# EAGLE design CN-Cape003 ohne HDMI (EAGLE 7.2.0)

## Sheet 1 of 5: Spannungsversorgung Verpolungsschutz ? Größe der Sicherung ? 1A oder 3A für Servos?
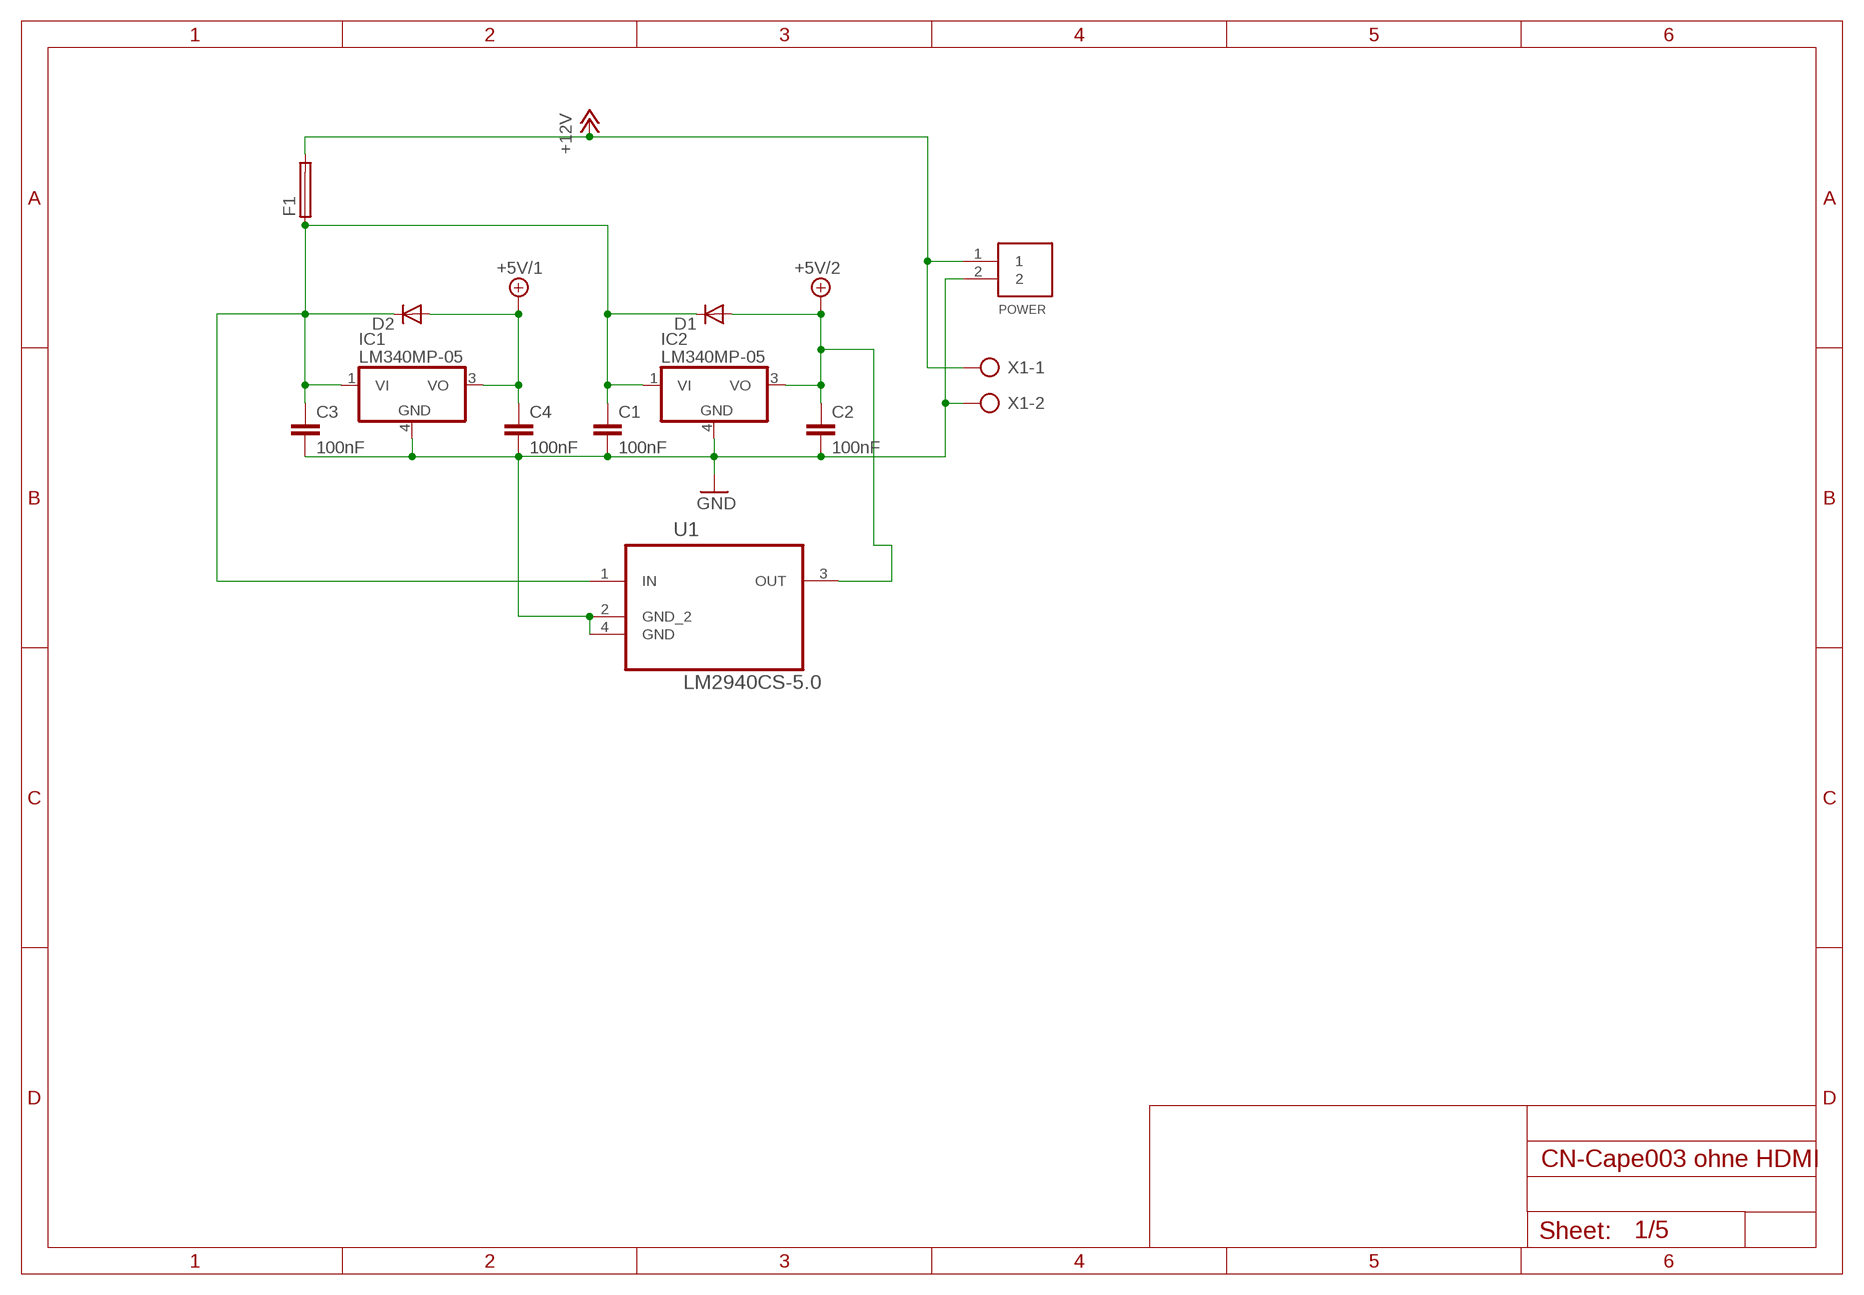
[diagram p0: schematic, sheet 1]

### Parts
C1  100nF  C-EUC0805  [C0805]
C2  100nF  C-EUC0805  [C0805]
C3  100nF  C-EUC0805  [C0805]
C4  100nF  C-EUC0805  [C0805]
D1  DIODE-SOD123  [SOD123]
D2  DIODE-SOD123  [SOD123]
F1  SH22,5  [SH22,5]
IC1  LM340MP-05  [SOT223]
IC2  LM340MP-05  [SOT223]
POWER  S2PIN  [S2B-EH]
U1  LM2940CS-5.0  [TO254P1435X464-4N]
X1  AK500/2-H  [AK500/2-H]

### Nets
12V_FUSED: C1.1 C3.1 D1.C D2.C F1.1 IC1.1(VI) IC2.1(VI) U1.1(IN)
+5V/1: C4.1 D2.A IC1.3(VO) ; also sheet 2,3,4
+5V/2: C2.1 D1.A IC2.3(VO) U1.3(OUT) ; also sheet 4,5
+12V: F1.2 POWER.1 X1.1
GND: C1.2 C2.2 C3.2 C4.2 IC1.4(GND) IC2.4(GND) POWER.2 U1.2(GND_2) U1.4(GND) X1.2 ; also sheet 2,3,4,5

## Sheet 2 of 5: BeagleBoard Black Expansion Header
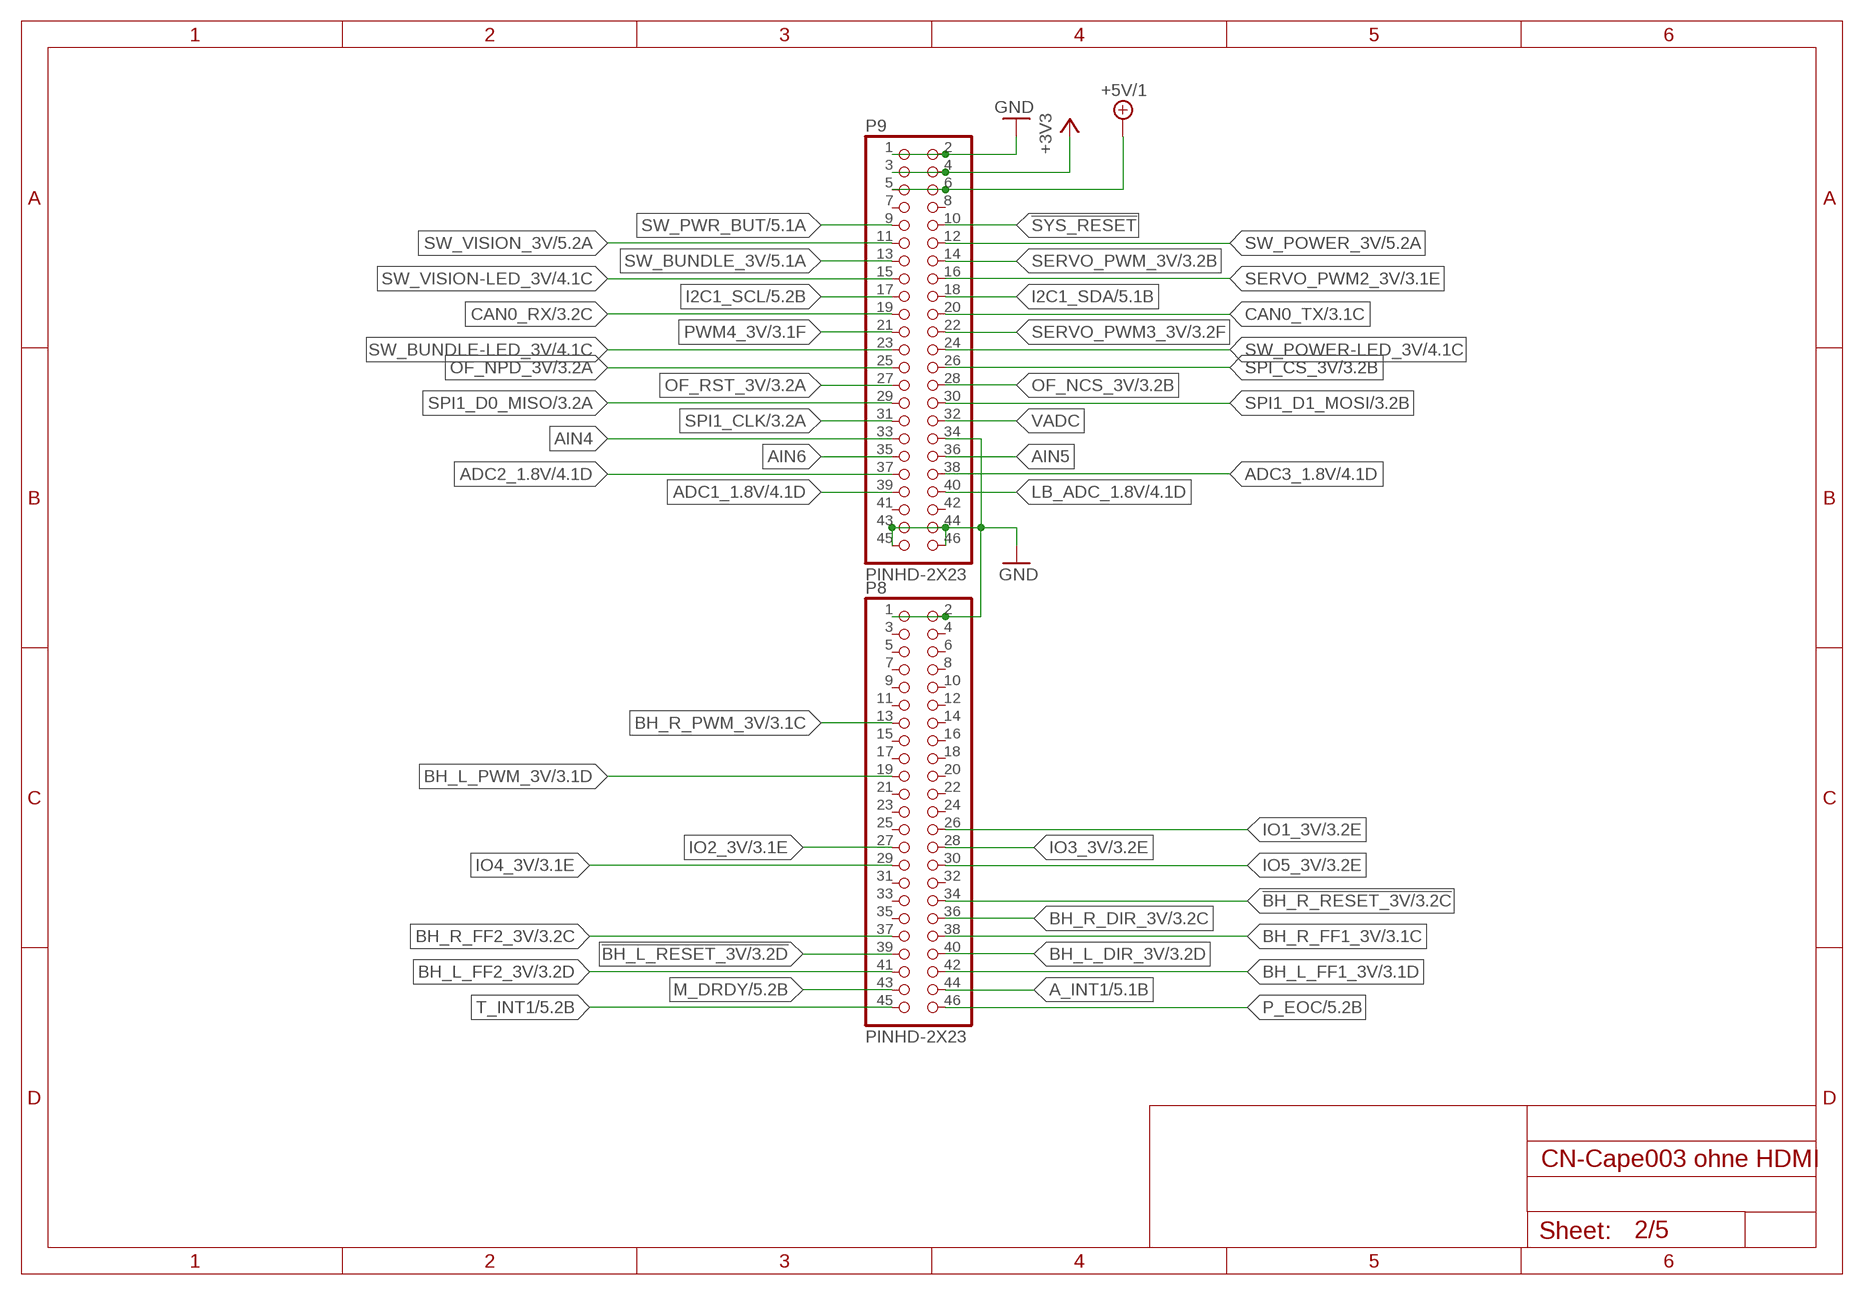
[diagram p1: schematic, sheet 2]

### Parts
P8  PINHD-2X23  [2X23]
P9  PINHD-2X23  [2X23]

### Nets
!BH_L_RESET_3V: P8.39 ; also sheet 3
!BH_R_RESET_3V: P8.34 ; also sheet 3
!SYS_RESET: P9.10
+3V3: P9.3 P9.4 ; also sheet 3,5
+5V/1: P9.5 P9.6 ; also sheet 1,3,4
A_INT1: P8.44 ; also sheet 5
ADC1_1.8V: P9.39 ; also sheet 4
ADC2_1.8V: P9.37 ; also sheet 4
ADC3_1.8V: P9.38 ; also sheet 4
AIN4: P9.33
AIN5: P9.36
AIN6: P9.35
BH_L_DIR_3V: P8.40 ; also sheet 3
BH_L_FF1_3V: P8.42 ; also sheet 3
BH_L_FF2_3V: P8.41 ; also sheet 3
BH_L_PWM_3V: P8.19 ; also sheet 3
BH_R_DIR_3V: P8.36 ; also sheet 3
BH_R_FF1_3V: P8.38 ; also sheet 3
BH_R_FF2_3V: P8.37 ; also sheet 3
BH_R_PWM_3V: P8.13 ; also sheet 3
CAN0_RX: P9.19 ; also sheet 3
CAN0_TX: P9.20 ; also sheet 3
GND: P8.1 P8.2 P9.1 P9.2 P9.34 P9.43 P9.44 P9.45 P9.46 ; also sheet 1,3,4,5
I2C1_SCL: P9.17 ; also sheet 5
I2C1_SDA: P9.18 ; also sheet 5
IO1_3V: P8.26 ; also sheet 3
IO2_3V: P8.27 ; also sheet 3
IO3_3V: P8.28 ; also sheet 3
IO4_3V: P8.29 ; also sheet 3
IO5_3V: P8.30 ; also sheet 3
LB_ADC_1.8V: P9.40 ; also sheet 4
M_DRDY: P8.43 ; also sheet 5
OF_NCS_3V: P9.28 ; also sheet 3
OF_NPD_3V: P9.25 ; also sheet 3
OF_RST_3V: P9.27 ; also sheet 3
P_EOC: P8.46 ; also sheet 5
PWM4_3V: P9.21 ; also sheet 3
SERVO_PWM2_3V: P9.16 ; also sheet 3
SERVO_PWM3_3V: P9.22 ; also sheet 3
SERVO_PWM_3V: P9.14 ; also sheet 3
SPI1_CLK: P9.31 ; also sheet 3
SPI1_D0_MISO: P9.29 ; also sheet 3
SPI1_D1_MOSI: P9.30 ; also sheet 3
SPI_CS_3V: P9.26 ; also sheet 3
SW_BUNDLE-LED_3V: P9.23 ; also sheet 4
SW_BUNDLE_3V: P9.13 ; also sheet 5
SW_POWER-LED_3V: P9.24 ; also sheet 4
SW_POWER_3V: P9.12 ; also sheet 5
SW_PWR_BUT: P9.9 ; also sheet 5
SW_VISION-LED_3V: P9.15 ; also sheet 4
SW_VISION_3V: P9.11 ; also sheet 5
T_INT1: P8.45 ; also sheet 5
VADC: P9.32
Unconnected: P8.3 P8.4 P8.5 P8.6 P8.7 P8.8 P8.9 P8.10 P8.11 P8.12 P8.14 P8.15 P8.16 P8.17 P8.18 P8.20 P8.21 P8.22 P8.23 P8.24 P8.25 P8.31 P8.32 P8.33 P8.35 P9.7 P9.8 P9.41 P9.42

## Sheet 3 of 5: Level Shifter
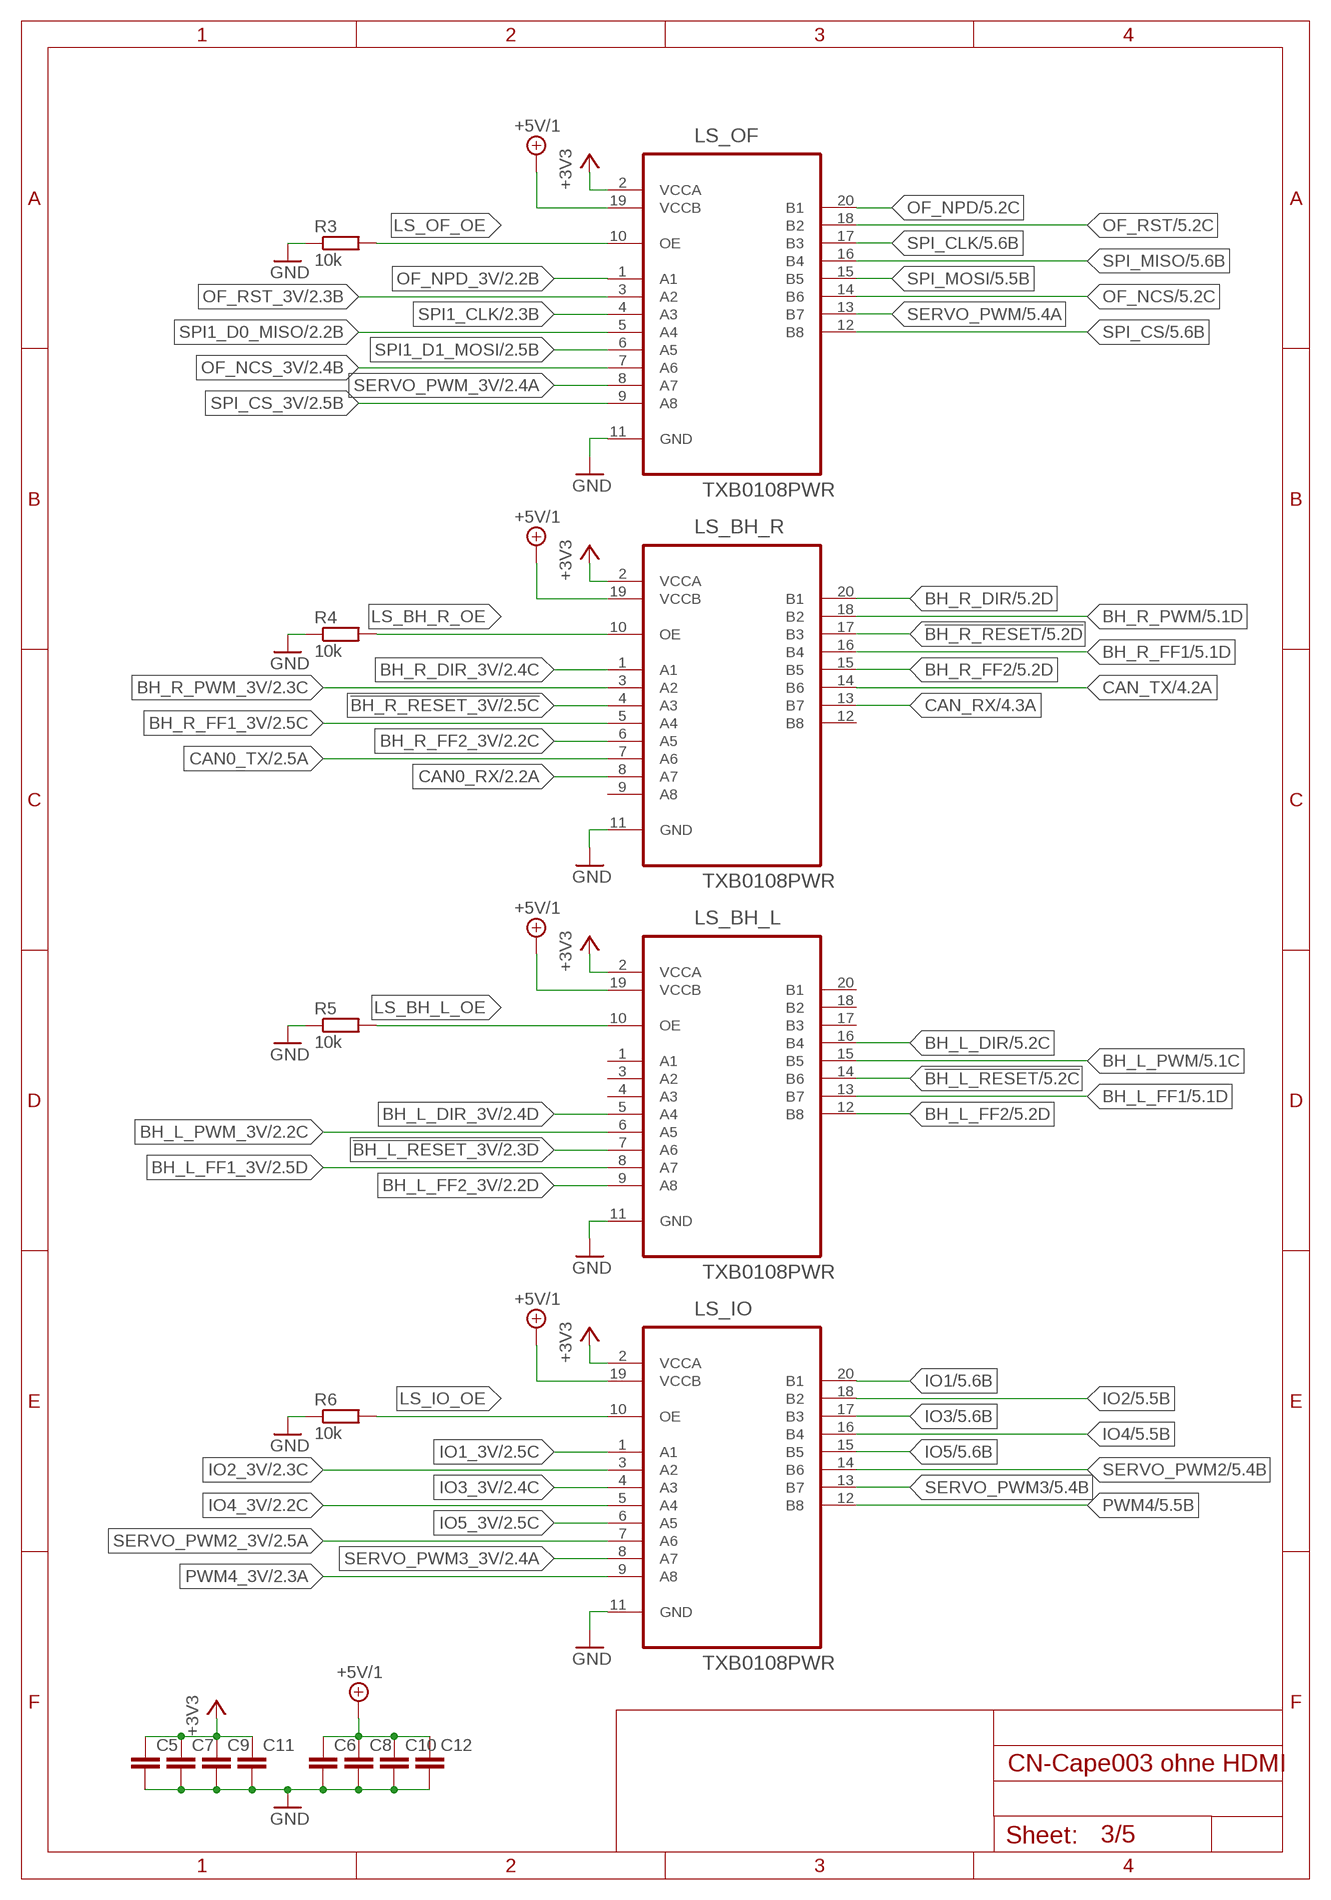
[diagram p2: schematic, sheet 3]

### Parts
C5  C-EUC0805  [C0805]
C6  C-EUC0805  [C0805]
C7  C-EUC0805  [C0805]
C8  C-EUC0805  [C0805]
C9  C-EUC0805  [C0805]
C10  C-EUC0805  [C0805]
C11  C-EUC0805  [C0805]
C12  C-EUC0805  [C0805]
LS_BH_L  TXB0108PWR  [SOP65P640X120-20N]
LS_BH_R  TXB0108PWR  [SOP65P640X120-20N]
LS_IO  TXB0108PWR  [SOP65P640X120-20N]
LS_OF  TXB0108PWR  [SOP65P640X120-20N]
R3  10k  R-EU_R0603  [R0603]
R4  10k  R-EU_R0603  [R0603]
R5  10k  R-EU_R0603  [R0603]
R6  10k  R-EU_R0603  [R0603]

### Nets
!BH_L_RESET: LS_BH_L.14(B6) ; also sheet 5
!BH_L_RESET_3V: LS_BH_L.7(A6) ; also sheet 2
!BH_R_RESET: LS_BH_R.17(B3) ; also sheet 5
!BH_R_RESET_3V: LS_BH_R.4(A3) ; also sheet 2
+3V3: C5.1 C7.1 C9.1 C11.1 LS_BH_L.2(VCCA) LS_BH_R.2(VCCA) LS_IO.2(VCCA) LS_OF.2(VCCA) ; also sheet 2,5
+5V/1: C6.1 C8.1 C10.1 C12.1 LS_BH_L.19(VCCB) LS_BH_R.19(VCCB) LS_IO.19(VCCB) LS_OF.19(VCCB) ; also sheet 1,2,4
BH_L_DIR: LS_BH_L.16(B4) ; also sheet 5
BH_L_DIR_3V: LS_BH_L.5(A4) ; also sheet 2
BH_L_FF1: LS_BH_L.13(B7) ; also sheet 5
BH_L_FF1_3V: LS_BH_L.8(A7) ; also sheet 2
BH_L_FF2: LS_BH_L.12(B8) ; also sheet 5
BH_L_FF2_3V: LS_BH_L.9(A8) ; also sheet 2
BH_L_PWM: LS_BH_L.15(B5) ; also sheet 5
BH_L_PWM_3V: LS_BH_L.6(A5) ; also sheet 2
BH_R_DIR: LS_BH_R.20(B1) ; also sheet 5
BH_R_DIR_3V: LS_BH_R.1(A1) ; also sheet 2
BH_R_FF1: LS_BH_R.16(B4) ; also sheet 5
BH_R_FF1_3V: LS_BH_R.5(A4) ; also sheet 2
BH_R_FF2: LS_BH_R.15(B5) ; also sheet 5
BH_R_FF2_3V: LS_BH_R.6(A5) ; also sheet 2
BH_R_PWM: LS_BH_R.18(B2) ; also sheet 5
BH_R_PWM_3V: LS_BH_R.3(A2) ; also sheet 2
CAN0_RX: LS_BH_R.8(A7) ; also sheet 2
CAN0_TX: LS_BH_R.7(A6) ; also sheet 2
CAN_RX: LS_BH_R.13(B7) ; also sheet 4
CAN_TX: LS_BH_R.14(B6) ; also sheet 4
GND: C5.2 C6.2 C7.2 C8.2 C9.2 C10.2 C11.2 C12.2 LS_BH_L.11(GND) LS_BH_R.11(GND) LS_IO.11(GND) LS_OF.11(GND) R3.1 R4.1 R5.1 R6.1 ; also sheet 1,2,4,5
IO1: LS_IO.20(B1) ; also sheet 5
IO1_3V: LS_IO.1(A1) ; also sheet 2
IO2: LS_IO.18(B2) ; also sheet 5
IO2_3V: LS_IO.3(A2) ; also sheet 2
IO3: LS_IO.17(B3) ; also sheet 5
IO3_3V: LS_IO.4(A3) ; also sheet 2
IO4: LS_IO.16(B4) ; also sheet 5
IO4_3V: LS_IO.5(A4) ; also sheet 2
IO5: LS_IO.15(B5) ; also sheet 5
IO5_3V: LS_IO.6(A5) ; also sheet 2
LS_BH_L_OE: LS_BH_L.10(OE) R5.2
LS_BH_R_OE: LS_BH_R.10(OE) R4.2
LS_IO_OE: LS_IO.10(OE) R6.2
LS_OF_OE: LS_OF.10(OE) R3.2
OF_NCS: LS_OF.14(B6) ; also sheet 5
OF_NCS_3V: LS_OF.7(A6) ; also sheet 2
OF_NPD: LS_OF.20(B1) ; also sheet 5
OF_NPD_3V: LS_OF.1(A1) ; also sheet 2
OF_RST: LS_OF.18(B2) ; also sheet 5
OF_RST_3V: LS_OF.3(A2) ; also sheet 2
PWM4: LS_IO.12(B8) ; also sheet 5
PWM4_3V: LS_IO.9(A8) ; also sheet 2
SERVO_PWM: LS_OF.13(B7) ; also sheet 5
SERVO_PWM2: LS_IO.14(B6) ; also sheet 5
SERVO_PWM2_3V: LS_IO.7(A6) ; also sheet 2
SERVO_PWM3: LS_IO.13(B7) ; also sheet 5
SERVO_PWM3_3V: LS_IO.8(A7) ; also sheet 2
SERVO_PWM_3V: LS_OF.8(A7) ; also sheet 2
SPI1_CLK: LS_OF.4(A3) ; also sheet 2
SPI1_D0_MISO: LS_OF.5(A4) ; also sheet 2
SPI1_D1_MOSI: LS_OF.6(A5) ; also sheet 2
SPI_CLK: LS_OF.17(B3) ; also sheet 5
SPI_CS: LS_OF.12(B8) ; also sheet 5
SPI_CS_3V: LS_OF.9(A8) ; also sheet 2
SPI_MISO: LS_OF.16(B4) ; also sheet 5
SPI_MOSI: LS_OF.15(B5) ; also sheet 5
Unconnected: LS_BH_L.1(A1) LS_BH_L.3(A2) LS_BH_L.4(A3) LS_BH_L.17(B3) LS_BH_L.18(B2) LS_BH_L.20(B1) LS_BH_R.9(A8) LS_BH_R.12(B8)

## Sheet 4 of 5: CAN- Bus & LED Transistoren
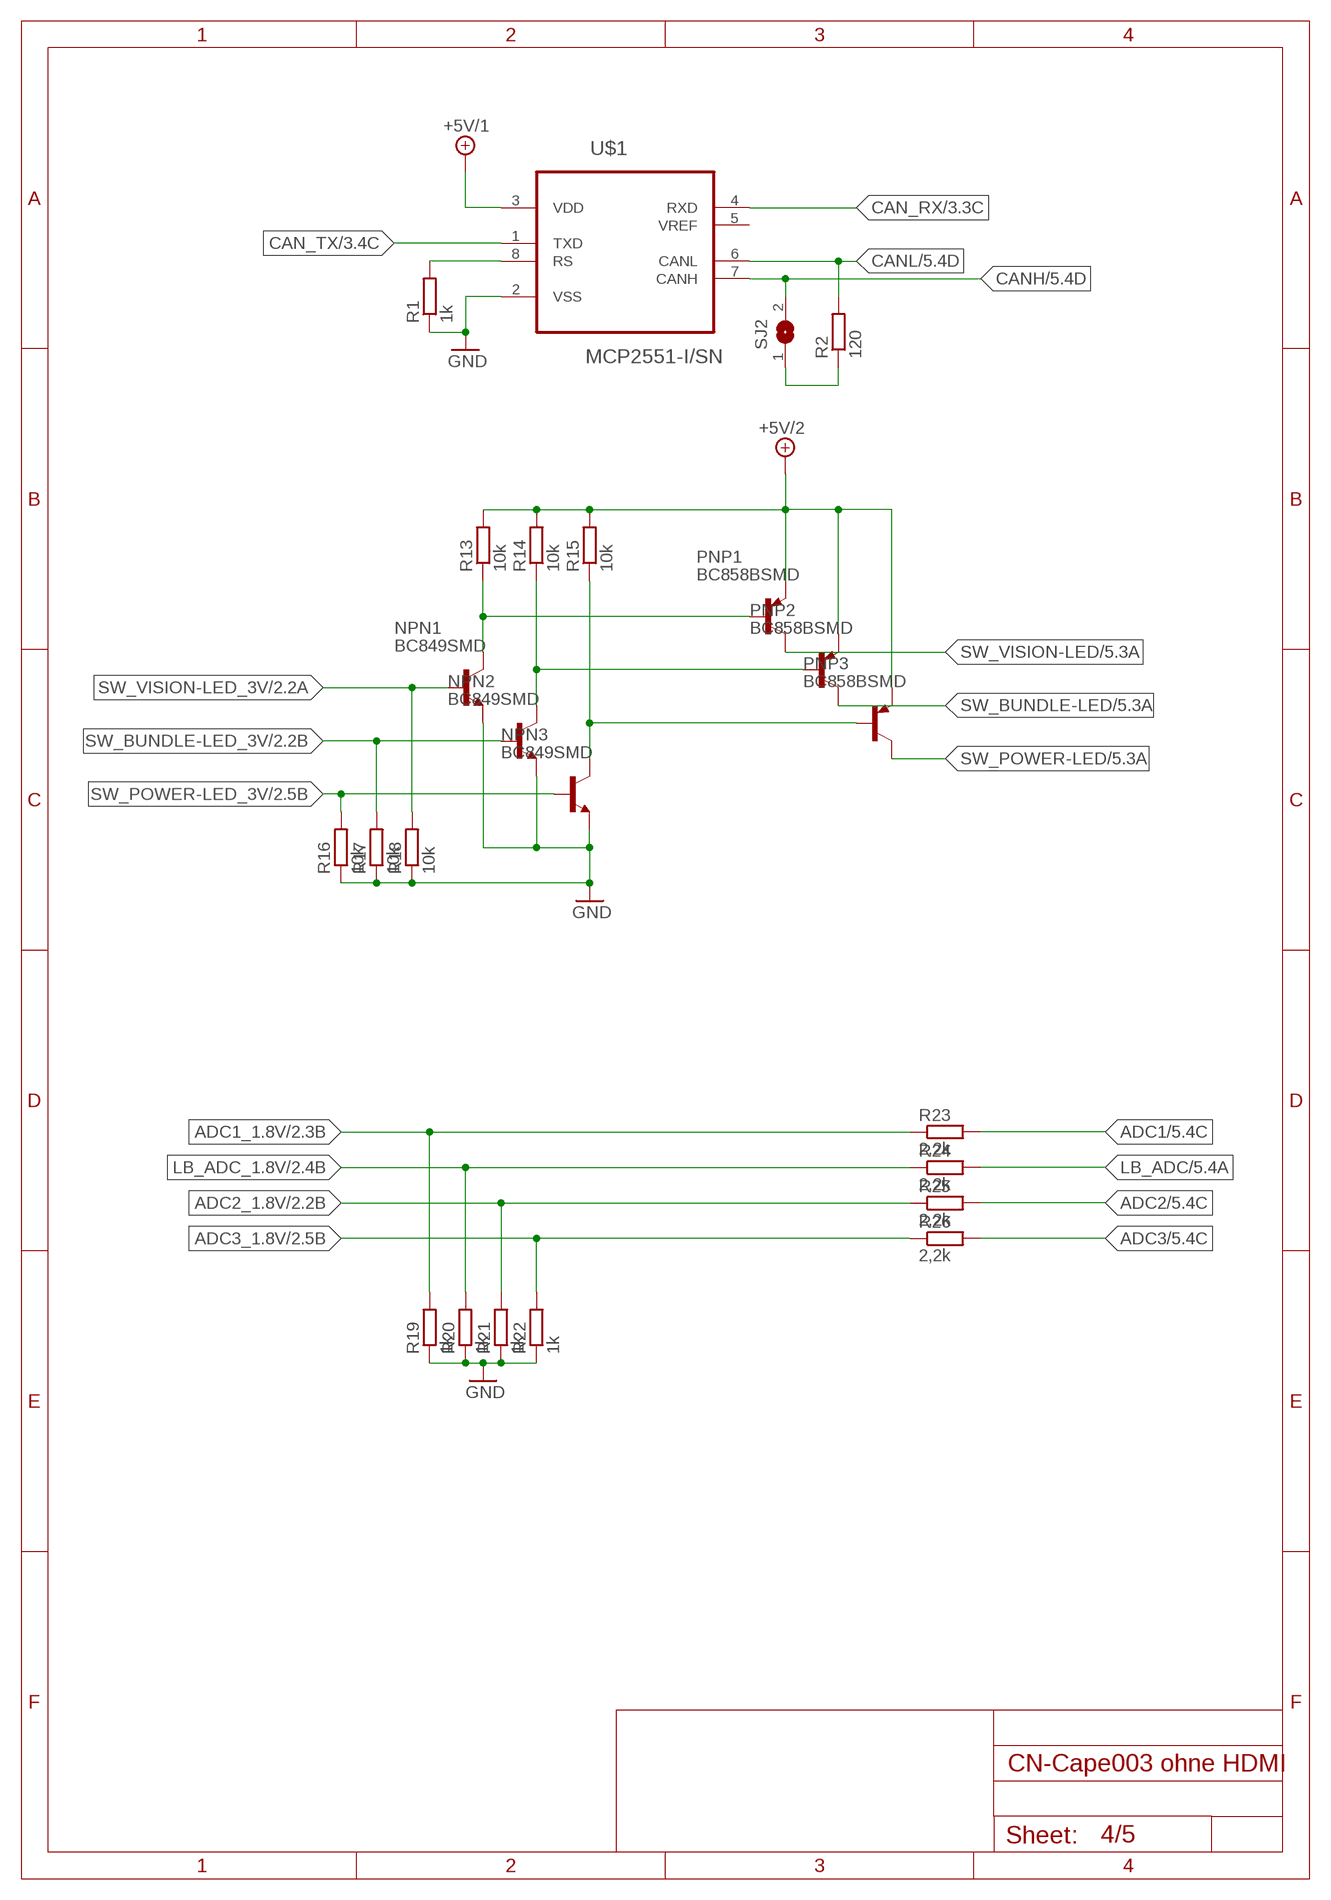
[diagram p3: schematic, sheet 4]

### Parts
NPN1  BC849SMD  [SOT23-BEC]
NPN2  BC849SMD  [SOT23-BEC]
NPN3  BC849SMD  [SOT23-BEC]
PNP1  BC858BSMD  [SOT23-BEC]
PNP2  BC858BSMD  [SOT23-BEC]
PNP3  BC858BSMD  [SOT23-BEC]
R1  1k  R-EU_R0603  [R0603]
R2  120  R-EU_R0603  [R0603]
R13  10k  R-EU_R0603  [R0603]
R14  10k  R-EU_R0603  [R0603]
R15  10k  R-EU_R0603  [R0603]
R16  10k  R-EU_R0603  [R0603]
R17  10k  R-EU_R0603  [R0603]
R18  10k  R-EU_R0603  [R0603]
R19  1k  R-EU_R0603  [R0603]
R20  1k  R-EU_R0603  [R0603]
R21  1k  R-EU_R0603  [R0603]
R22  1k  R-EU_R0603  [R0603]
R23  2,2k  R-EU_R0603  [R0603]
R24  2,2k  R-EU_R0603  [R0603]
R25  2,2k  R-EU_R0603  [R0603]
R26  2,2k  R-EU_R0603  [R0603]
SJ2  SJ  [SJ]
U$1  MCP2551-I/SN  [SOIC127P600X175-8N]

### Nets
+5V/1: U$1.3(VDD) ; also sheet 1,2,3
+5V/2: PNP1.E PNP2.E PNP3.E R13.2 R14.2 R15.2 ; also sheet 1,5
ADC1: R23.2 ; also sheet 5
ADC1_1.8V: R19.2 R23.1 ; also sheet 2
ADC2: R25.2 ; also sheet 5
ADC2_1.8V: R21.2 R25.1 ; also sheet 2
ADC3: R26.2 ; also sheet 5
ADC3_1.8V: R22.2 R26.1 ; also sheet 2
CAN_RX: U$1.4(RXD) ; also sheet 3
CAN_TX: U$1.1(TXD) ; also sheet 3
CANH: SJ2.2 U$1.7(CANH) ; also sheet 5
CANL: R2.2 U$1.6(CANL) ; also sheet 5
GND: NPN1.E NPN2.E NPN3.E R1.1 R16.1 R17.1 R18.1 R19.1 R20.1 R21.1 R22.1 U$1.2(VSS) ; also sheet 1,2,3,5
LB_ADC: R24.2 ; also sheet 5
LB_ADC_1.8V: R20.2 R24.1 ; also sheet 2
N$1: NPN1.C PNP1.B R13.1
N$2: NPN2.C PNP2.B R14.1
N$4: NPN3.C PNP3.B R15.1
N$9: R1.2 U$1.8(RS)
N$10: R2.1 SJ2.1
SW_BUNDLE-LED: PNP2.C ; also sheet 5
SW_BUNDLE-LED_3V: NPN2.B R17.2 ; also sheet 2
SW_POWER-LED: PNP3.C ; also sheet 5
SW_POWER-LED_3V: NPN3.B R16.2 ; also sheet 2
SW_VISION-LED: PNP1.C ; also sheet 5
SW_VISION-LED_3V: NPN1.B R18.2 ; also sheet 2
Unconnected: U$1.5(VREF)

## Sheet 5 of 5: Connector
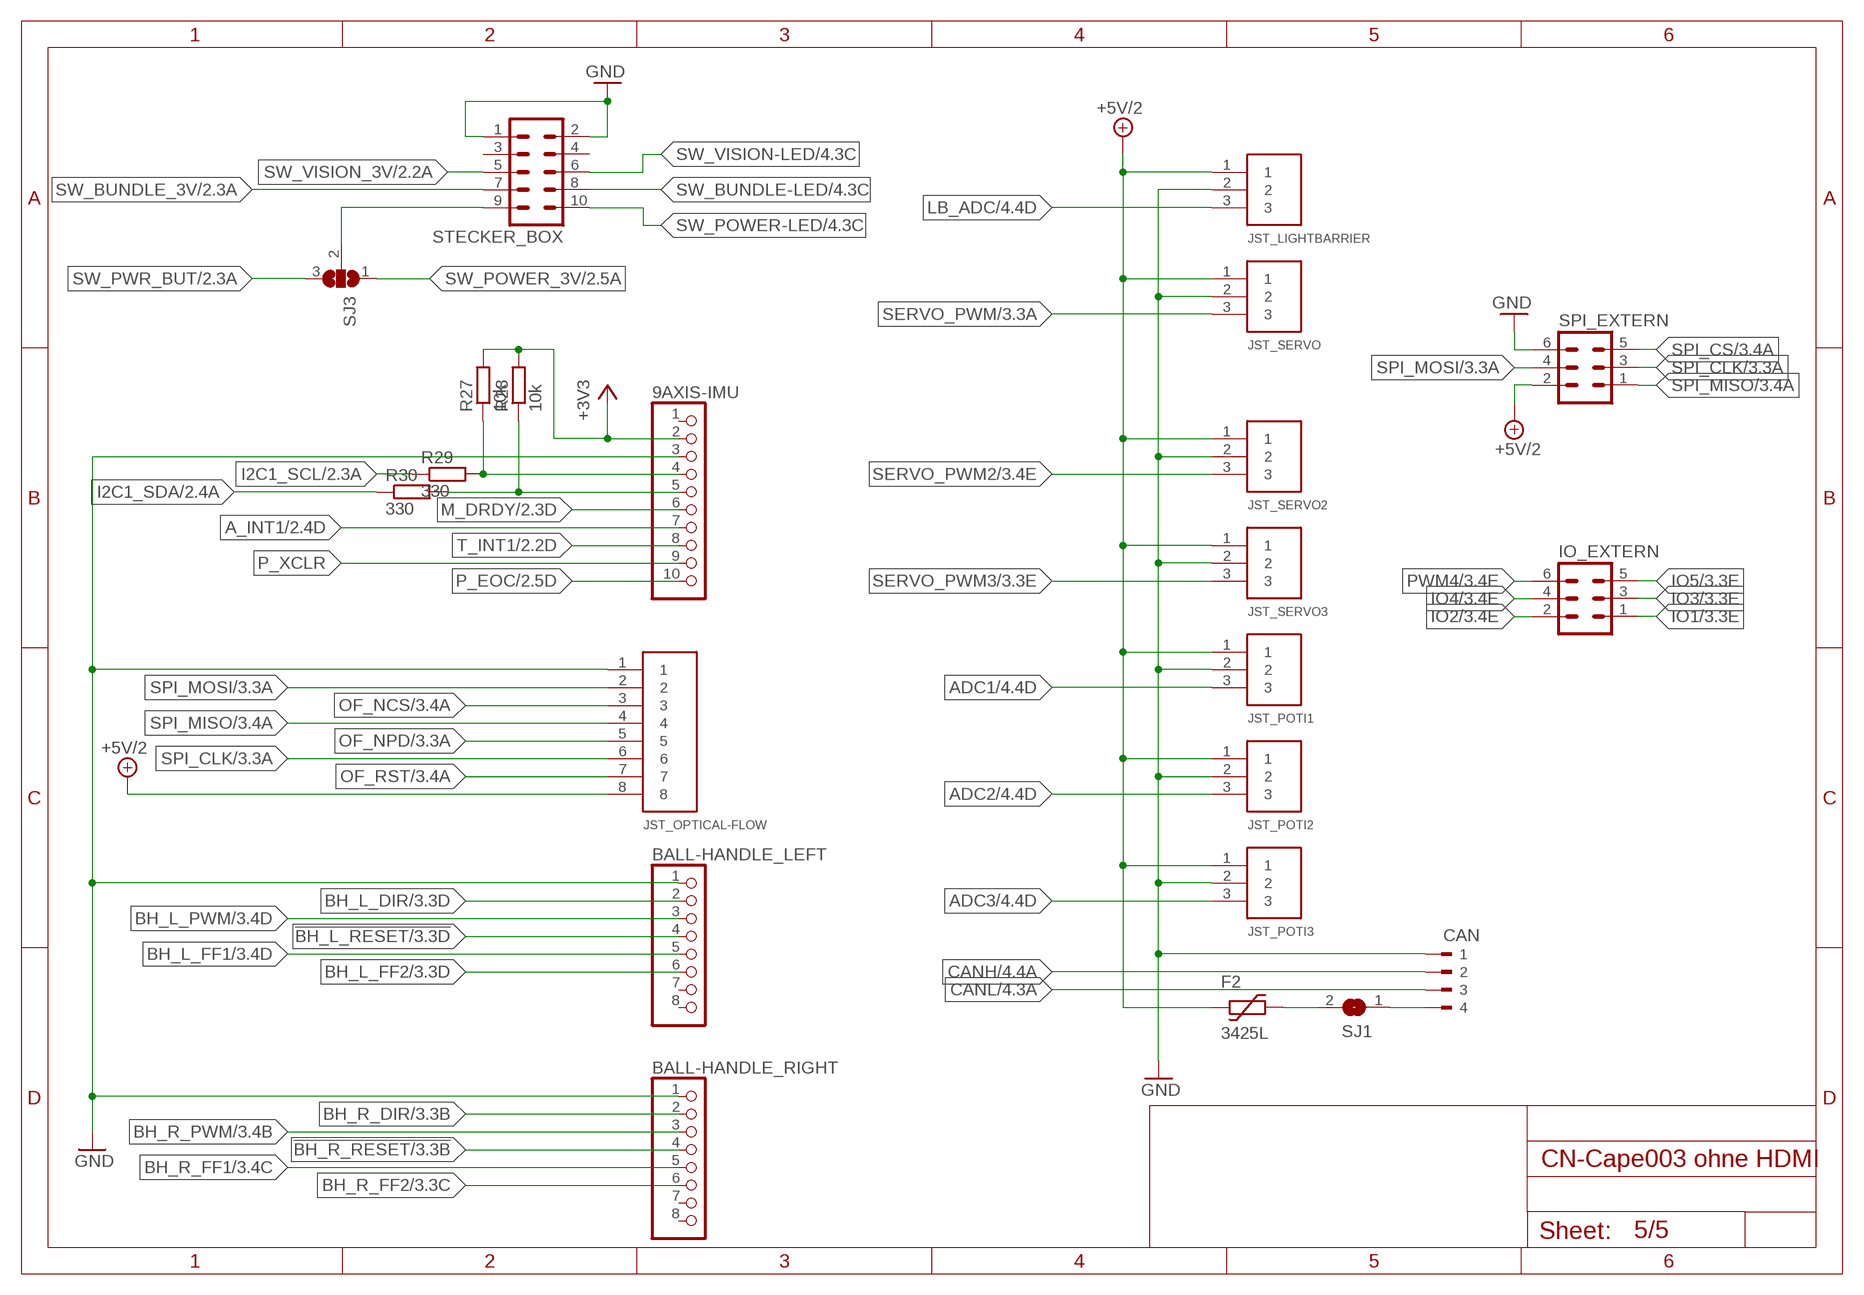
[diagram p4: schematic, sheet 5]

### Parts
9AXIS-IMU  PINHD-1X10  [1X10]
BALL-HANDLE_LEFT  PINHD-1X8  [1X08]
BALL-HANDLE_RIGHT  PINHD-1X8  [1X08]
CAN  90-4  [90-4]
F2  3425L  [3425L]
IO_EXTERN  ML6  [ML6]
JST_LIGHTBARRIER  S3PIN  [S3B-EH]
JST_OPTICAL-FLOW  S8PIN  [S8B-EH]
JST_POTI1  3PIN  [B3B-EH]
JST_POTI2  3PIN  [B3B-EH]
JST_POTI3  3PIN  [B3B-EH]
JST_SERVO  S3PIN  [S3B-EH]
JST_SERVO2  3PIN  [B3B-EH]
JST_SERVO3  3PIN  [B3B-EH]
R27  10k  R-EU_R0603  [R0603]
R28  10k  R-EU_R0603  [R0603]
R29  330  R-EU_R0603  [R0603]
R30  330  R-EU_R0603  [R0603]
SJ1  SJ  [SJ]
SJ3  SJ2W  [SJ_2]
SPI_EXTERN  ML6  [ML6]
STECKER_BOX  ML10  [ML10]

### Nets
5V/2_F&J: CAN.4 SJ1.1
5V/2_FUSED: F2.P$2 SJ1.2
!BH_L_RESET: BALL-HANDLE_LEFT.4 ; also sheet 3
!BH_R_RESET: BALL-HANDLE_RIGHT.4 ; also sheet 3
+3V3: 9AXIS-IMU.2 R27.2 R28.2 ; also sheet 2,3
+5V/2: F2.P$1 JST_LIGHTBARRIER.1 JST_OPTICAL-FLOW.8 JST_POTI1.1 JST_POTI2.1 JST_POTI3.1 JST_SERVO2.1 JST_SERVO3.1 JST_SERVO.1 SPI_EXTERN.2 ; also sheet 1,4
A_INT1: 9AXIS-IMU.7 ; also sheet 2
ADC1: JST_POTI1.3 ; also sheet 4
ADC2: JST_POTI2.3 ; also sheet 4
ADC3: JST_POTI3.3 ; also sheet 4
BH_L_DIR: BALL-HANDLE_LEFT.2 ; also sheet 3
BH_L_FF1: BALL-HANDLE_LEFT.5 ; also sheet 3
BH_L_FF2: BALL-HANDLE_LEFT.6 ; also sheet 3
BH_L_PWM: BALL-HANDLE_LEFT.3 ; also sheet 3
BH_R_DIR: BALL-HANDLE_RIGHT.2 ; also sheet 3
BH_R_FF1: BALL-HANDLE_RIGHT.5 ; also sheet 3
BH_R_FF2: BALL-HANDLE_RIGHT.6 ; also sheet 3
BH_R_PWM: BALL-HANDLE_RIGHT.3 ; also sheet 3
CANH: CAN.2 ; also sheet 4
CANL: CAN.3 ; also sheet 4
GND: 9AXIS-IMU.3 BALL-HANDLE_LEFT.1 BALL-HANDLE_RIGHT.1 CAN.1 JST_LIGHTBARRIER.2 JST_OPTICAL-FLOW.1 JST_POTI1.2 JST_POTI2.2 JST_POTI3.2 JST_SERVO2.2 JST_SERVO3.2 JST_SERVO.2 SPI_EXTERN.6 STECKER_BOX.1 STECKER_BOX.2 ; also sheet 1,2,3,4
I2C1_SCL: R29.1 ; also sheet 2
I2C1_SDA: R30.1 ; also sheet 2
IO1: IO_EXTERN.1 ; also sheet 3
IO2: IO_EXTERN.2 ; also sheet 3
IO3: IO_EXTERN.3 ; also sheet 3
IO4: IO_EXTERN.4 ; also sheet 3
IO5: IO_EXTERN.5 ; also sheet 3
LB_ADC: JST_LIGHTBARRIER.3 ; also sheet 4
M_DRDY: 9AXIS-IMU.6 ; also sheet 2
OF_NCS: JST_OPTICAL-FLOW.3 ; also sheet 3
OF_NPD: JST_OPTICAL-FLOW.5 ; also sheet 3
OF_RST: JST_OPTICAL-FLOW.7 ; also sheet 3
P_EOC: 9AXIS-IMU.10 ; also sheet 2
P_XCLR: 9AXIS-IMU.9
PWM4: IO_EXTERN.6 ; also sheet 3
SCL: 9AXIS-IMU.4 R27.1 R29.2
SDA: 9AXIS-IMU.5 R28.1 R30.2
SERVO_PWM: JST_SERVO.3 ; also sheet 3
SERVO_PWM2: JST_SERVO2.3 ; also sheet 3
SERVO_PWM3: JST_SERVO3.3 ; also sheet 3
SPI_CLK: JST_OPTICAL-FLOW.6 SPI_EXTERN.3 ; also sheet 3
SPI_CS: SPI_EXTERN.5 ; also sheet 3
SPI_MISO: JST_OPTICAL-FLOW.4 SPI_EXTERN.1 ; also sheet 3
SPI_MOSI: JST_OPTICAL-FLOW.2 SPI_EXTERN.4 ; also sheet 3
SW3: SJ3.2 STECKER_BOX.9
SW_BUNDLE-LED: STECKER_BOX.8 ; also sheet 4
SW_BUNDLE_3V: STECKER_BOX.7 ; also sheet 2
SW_POWER-LED: STECKER_BOX.10 ; also sheet 4
SW_POWER_3V: SJ3.1 ; also sheet 2
SW_PWR_BUT: SJ3.3 ; also sheet 2
SW_VISION-LED: STECKER_BOX.6 ; also sheet 4
SW_VISION_3V: STECKER_BOX.5 ; also sheet 2
T_INT1: 9AXIS-IMU.8 ; also sheet 2
Unconnected: 9AXIS-IMU.1 BALL-HANDLE_LEFT.7 BALL-HANDLE_LEFT.8 BALL-HANDLE_RIGHT.7 BALL-HANDLE_RIGHT.8 STECKER_BOX.3 STECKER_BOX.4

## Library data of the parts
9AXIS-IMU = pinhead:PINHD-1X10: PIN HEADER
BALL-HANDLE_LEFT BALL-HANDLE_RIGHT = pinhead:PINHD-1X8: PIN HEADER
C1-C12 = rcl:C-EU: CAPACITOR, European symbol
CAN = con-weidmueller-sl35:90-4: WEIDMUELLER CLAMP CONNECTOR
D1 D2 = diode:DIODE-: DIODE; REICHELT: SD 101BW
F1 = fuse:SH22,5: FUSE HOLDER grid 22,5 mm, OGN0031 8201, Schurter (Buerklin)
F2 = ptc-littlefuse:3425L
IC1 IC2 = linear:LM340?-*: Positive VOLTAGE REGULATOR Source: http://cache.national.com/ds/LM/LM340.pdf
IO_EXTERN SPI_EXTERN = con-ml:ML6: HARTING
JST_LIGHTBARRIER JST_SERVO = jst_eh:S3PIN
JST_OPTICAL-FLOW = jst_eh:S8PIN
JST_POTI1-JST_POTI3 JST_SERVO2 JST_SERVO3 = jst_eh:3PIN
LS_BH_L LS_BH_R LS_IO LS_OF = TI-TXB0108PWR:TXB0108PWR: 8-BIT BIDIRECTIONAL VOLTAGE-LEVEL TRANSLATOR; MPN: TXB0108PWR; OC_FARNELL: 1494945; OC_NEWARK: 27M1151; PACKAGE: TSSOP-20; SUPPLIER: Texas Instruments
NPN1-NPN3 = transistor-npn:BC849*: NPN Transistor
P8 P9 = pinhead-2x23:PINHD-2X23
PNP1-PNP3 = transistor-pnp:BC858*: PNP Transistror
POWER = jst_eh:S2PIN
R1-R6 R13-R30 = rcl:R-EU_: RESISTOR, European symbol
SJ1 SJ2 = jumper:SJ: SMD solder JUMPER
SJ3 = jumper:SJ2W: SMD solder JUMPER
STECKER_BOX = con-ml:ML10: HARTING
U1 = LM2940CS:LM2940CS-5.0: Dropout Regulator; MPN: LM2940CS-5.0; OC_FARNELL: 9779850; OC_NEWARK: 07B6352; PACKAGE: TO-263-3; SUPPLIER: NationalSemiconductor
U$1 = Microchip-MCP2551-I_SN:MCP2551-I/SN: High-Speed CAN Transceiver; MPN: MCP2551-I/SN; OC_FARNELL: 9758569; OC_NEWARK: 69K7604; PACKAGE: SOIC-8; SUPPLIER: Microchip
X1 = con-ptr500:AK500/2-H: CONNECTOR Aug. 2004 / PTR Meßtechnik: Die Bezeichnung der Serie AK505 wurde geändert. Es handelt sich hierbei um AK500 in horizontaler Ausführung.

## Board
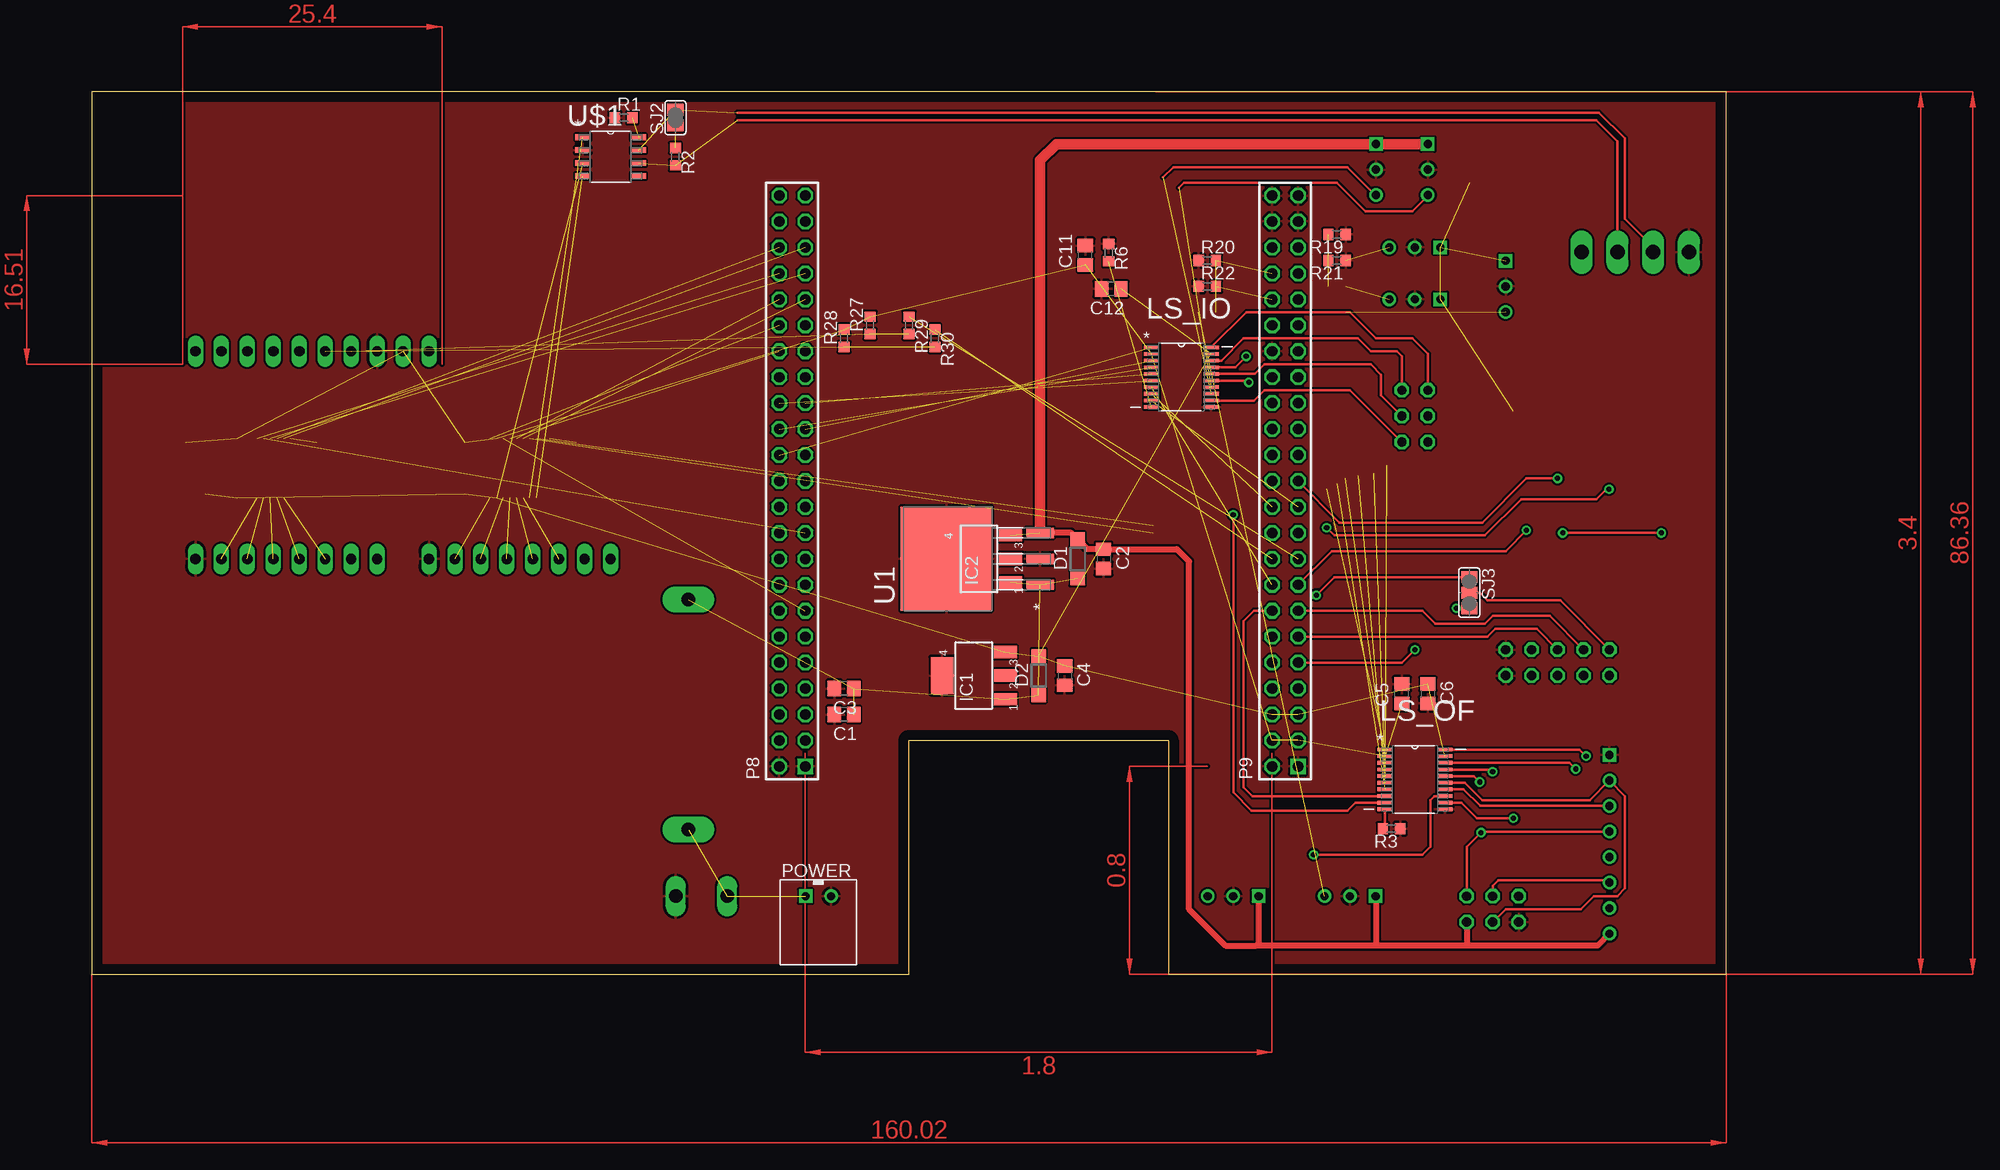
[diagram p5: board, top side]
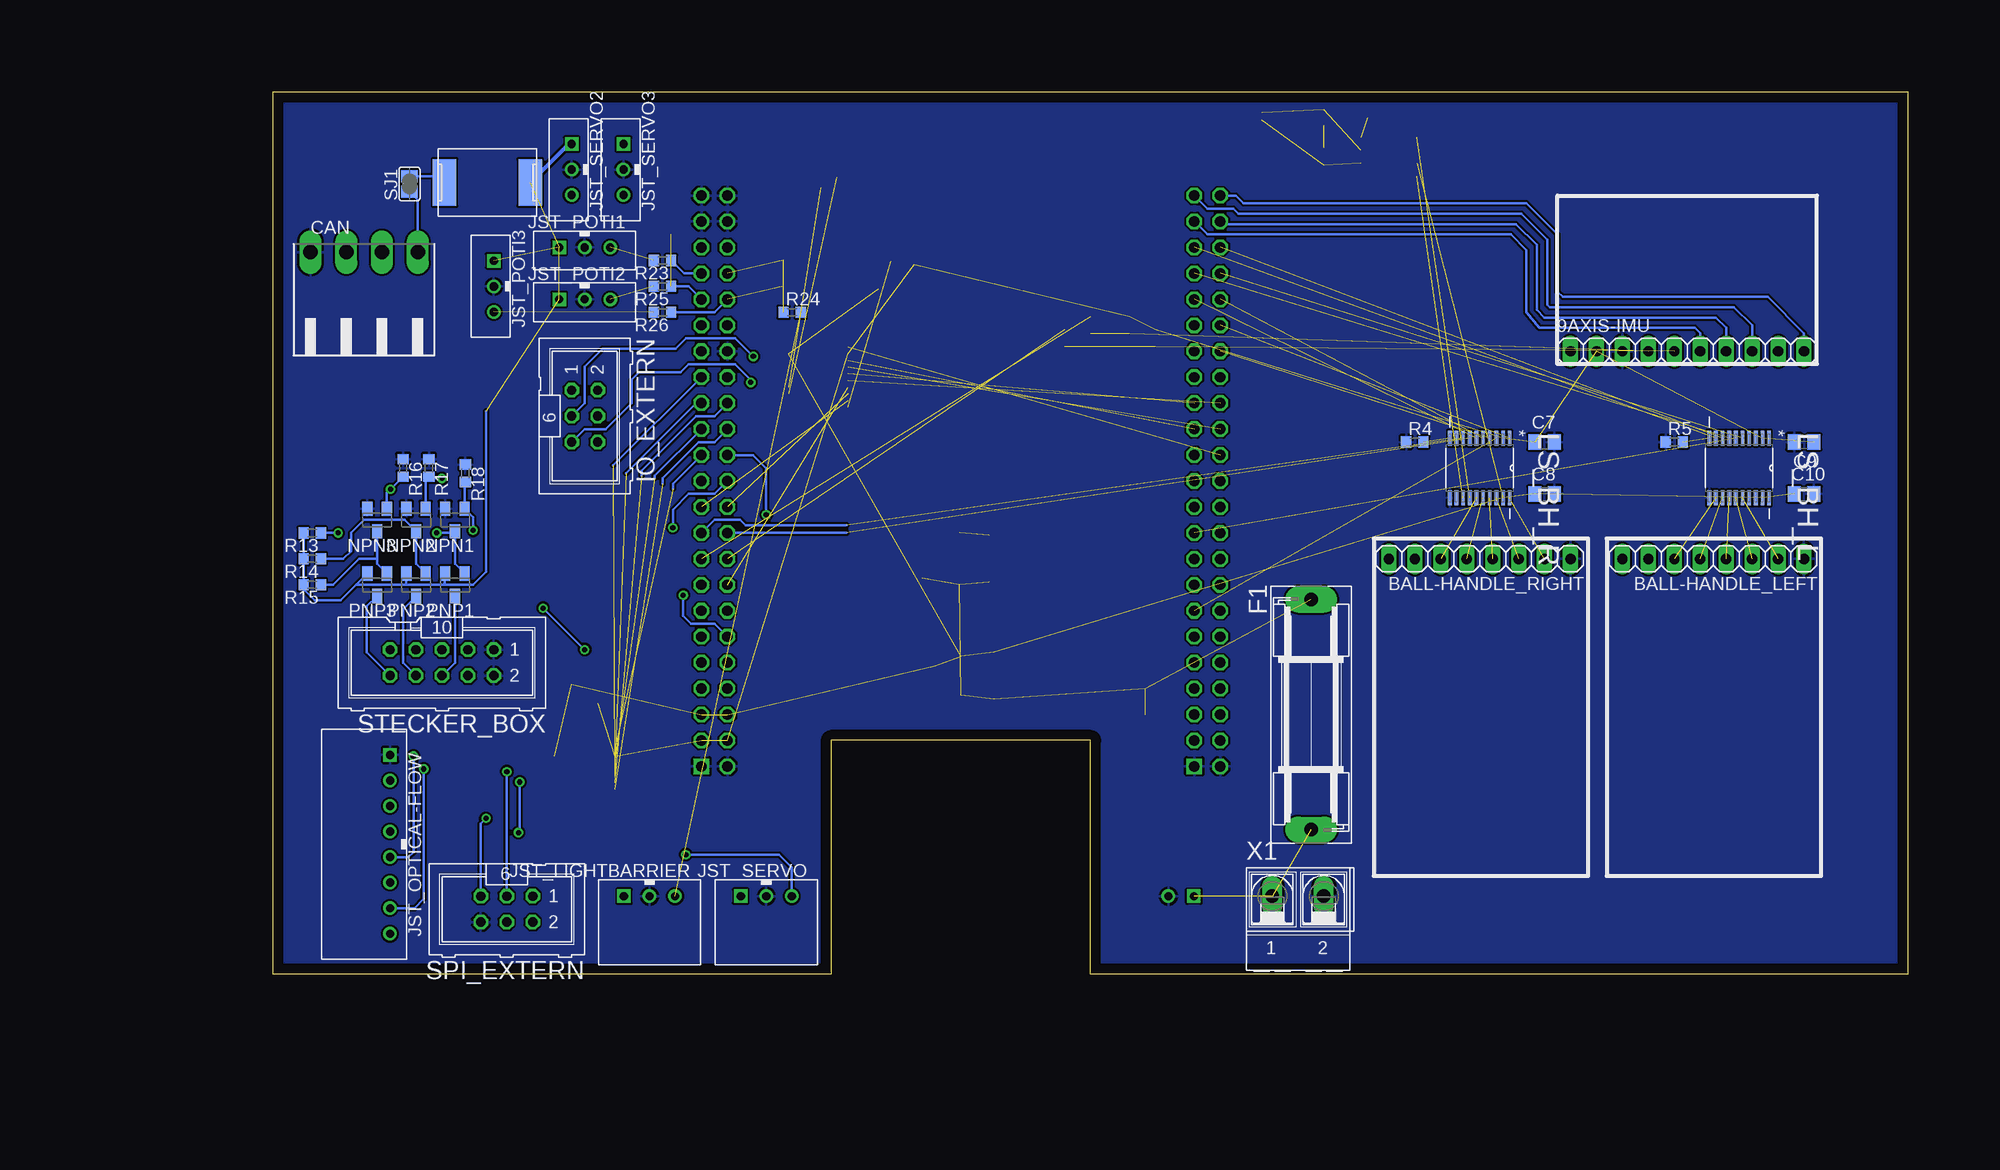
[diagram p6: board, bottom side, seen from below]

Size 160.02 x 86.36 mm. Coordinates in mm from the lower left corner, seen from the top.
Outline: 0,0 80.01,0 80.01,22.86 105.41,22.86 105.41,0 160.02,0 160.02,86.36 0,86.36 0,0
Copper layers (1*16): Top 0.035mm / dielectric 1.5mm / Bottom 0.035mm
Design rules "default": minimum track width 10mil, minimum drill 24mil, track to track 8mil, track to pad 8mil, pad to pad 8mil, via to via 8mil, smd to smd 8mil, copper to edge 40mil, drill to drill 8mil, minimum pad ring 10mil, minimum via ring 8mil, stop-mask expansion 4mil, vias tented up to drill 0mil, thermal gap 10mil

### Footprints (pad centres in the part's own frame; a part is rotated, then mirrored left to right if it is on the bottom)
1X10 = drill 1.016 long: 1 -11.43,0; 2 -8.89,0; 3 -6.35,0; 4 -3.81,0; 5 -1.27,0; 6 1.27,0; 7 3.81,0; 8 6.35,0; 9 8.89,0; 10 11.43,0
1X08 = drill 1.016 long: 1 -8.89,0; 2 -6.35,0; 3 -3.81,0; 4 -1.27,0; 5 1.27,0; 6 3.81,0; 7 6.35,0; 8 8.89,0
C0805 = smd 1.3 x 1.5: 1 -0.95,0; 2 0.95,0
90-4 = drill 1.422 long: 1 -5.25,5.25; 2 -1.75,5.25; 3 1.75,5.25; 4 5.25,5.25
SOD123 = smd 1.4 x 1.4: A 1.9,0; C -1.9,0
SH22,5 = drill 1.321 pad 2.54 long: 1 -11.252,0; 2 11.252,0
3425L = smd 2.29 x 4.57: P$1 -4.2,0; P$2 4.2,0
SOT223 = smd 1.219 x 2.235: 1 -2.311,-3.099; 2 0,-3.099; 3 2.311,-3.099 | smd 3.6 x 2.2: 4 0,3.099
ML6 = drill 0.914 octagon: 1 -2.54,-1.27; 2 -2.54,1.27; 3 0,-1.27; 4 0,1.27; 5 2.54,-1.27; 6 2.54,1.27
S3B-EH = drill 0.813 square: 1 2.5,0 | drill 0.813: 2 0,0; 3 -2.5,0
S8B-EH = drill 0.813 square: 1 8.75,0 | drill 0.813: 2 6.25,0; 3 3.75,0; 4 1.25,0; 5 -1.25,0; 6 -3.75,0; 7 -6.25,0; 8 -8.75,0
B3B-EH = drill 0.813 square: 1 2.5,0 | drill 0.813: 2 0,0; 3 -2.5,0
SOP65P640X120-20N = smd 1.473 x 0.356: 1 -2.921,2.921; 2 -2.921,2.286; 3 -2.921,1.626; 4 -2.921,0.965; 5 -2.921,0.33; 6 -2.921,-0.33; 7 -2.921,-0.965; 8 -2.921,-1.626; 9 -2.921,-2.286; 10 -2.921,-2.921; 11 2.921,-2.921; 12 2.921,-2.286; 13 2.921,-1.626; 14 2.921,-0.965; 15 2.921,-0.33; 16 2.921,0.33; 17 2.921,0.965; 18 2.921,1.626; 19 2.921,2.286; 20 2.921,2.921
SOT23-BEC = smd 1 x 1.4: B -0.95,-1.1; C 0,1.1; E 0.95,-1.1
2X23 = drill 1.016 square: 1 -26.67,-1.27 | drill 1.016 octagon: 2 -26.67,1.27; 3 -24.13,-1.27; 4 -24.13,1.27; 5 -21.59,-1.27; 6 -21.59,1.27; 7 -19.05,-1.27; 8 -19.05,1.27; 9 -16.51,-1.27; 10 -16.51,1.27; 11 -13.97,-1.27; 12 -13.97,1.27; 13 -11.43,-1.27; 14 -11.43,1.27; 15 -8.89,-1.27; 16 -8.89,1.27; 17 -6.35,-1.27; 18 -6.35,1.27; 19 -3.81,-1.27; 20 -3.81,1.27; 21 -1.27,-1.27; 22 -1.27,1.27; 23 1.27,-1.27; 24 1.27,1.27; 25 3.81,-1.27; 26 3.81,1.27; 27 6.35,-1.27; 28 6.35,1.27; 29 8.89,-1.27; 30 8.89,1.27; 31 11.43,-1.27; 32 11.43,1.27; 33 13.97,-1.27; 34 13.97,1.27; 35 16.51,-1.27; 36 16.51,1.27; 37 19.05,-1.27; 38 19.05,1.27; 39 21.59,-1.27; 40 21.59,1.27; 41 24.13,-1.27; 42 24.13,1.27; 43 26.67,-1.27; 44 26.67,1.27; 45 29.21,-1.27; 46 29.21,1.27
S2B-EH = drill 0.813 square: 1 2.5,0 | drill 0.813: 2 0,0
R0603 = smd 1 x 1.1: 1 -0.85,0; 2 0.85,0
SJ = smd 1.168 x 1.6: 1 -0.762,0; 2 0.762,0
SJ_2 = smd 1.168 x 1.6: 1 -1.524,0; 2 0,0; 3 1.524,0
ML10 = drill 0.914 octagon: 1 -5.08,-1.27; 2 -5.08,1.27; 3 -2.54,-1.27; 4 -2.54,1.27; 5 0,-1.27; 6 0,1.27; 7 2.54,-1.27; 8 2.54,1.27; 9 5.08,-1.27; 10 5.08,1.27
TO254P1435X464-4N = smd 1.016 x 2.692: 1 -2.54,-9.042; 2 0,-9.042; 3 2.54,-9.042 | smd 10.16 x 8.941: 4 0,0.152
SOIC127P600X175-8N = smd 1.473 x 0.559: 1 -2.718,1.905; 2 -2.718,0.635; 3 -2.718,-0.635; 4 -2.718,-1.905; 5 2.718,-1.905; 6 2.718,-0.635; 7 2.718,0.635; 8 2.718,1.905
AK500/2-H = drill 1.321 long: 1 -2.515,0; 2 2.515,0

### Placement (x,y rotation side)
9AXIS-IMU  21.59,60.96 0 bottom
BALL-HANDLE_LEFT  19.05,40.64 180 bottom
BALL-HANDLE_RIGHT  41.91,40.64 180 bottom
C1  73.66,25.4 180 top
C2  99.06,40.64 270 top
C3  73.66,27.94 180 top
C4  95.25,29.21 270 top
C5  128.27,27.43 90 top
C6  130.81,27.43 270 top
C7  35.56,52.07 0 bottom
C8  35.56,46.99 0 bottom
C9  10.16,52.07 180 bottom
C10  10.16,46.99 0 bottom
C11  97.28,70.36 90 top
C12  99.82,67.06 180 top
CAN  151.13,65.41 0 bottom
D1  96.52,40.64 90 top
D2  92.71,29.21 90 top
F1  58.42,25.4 270 bottom
F2  139.06,77.47 180 bottom
IC1  86.36,29.21 90 top
IC2  86.87,40.64 90 top
IO_EXTERN  129.54,54.61 270 bottom
JST_LIGHTBARRIER  123.19,7.62 180 bottom
JST_OPTICAL-FLOW  148.59,12.7 90 bottom
JST_POTI1  129.54,71.12 180 bottom
JST_POTI2  129.54,66.04 180 bottom
JST_POTI3  138.43,67.31 90 bottom
JST_SERVO  111.76,7.62 180 bottom
JST_SERVO2  130.81,78.74 90 bottom
JST_SERVO3  125.73,78.74 90 bottom
LS_BH_L  16.51,49.53 270 bottom
LS_BH_R  41.91,49.53 270 bottom
LS_IO  106.68,58.42 0 top
LS_OF  129.54,19.05 0 top
NPN1  142.24,44.45 180 bottom
NPN2  146.05,44.45 180 bottom
NPN3  149.86,44.45 180 bottom
P8  68.58,46.99 90 top
P9  116.84,46.99 90 top
PNP1  142.24,38.1 180 bottom
PNP2  146.05,38.1 180 bottom
PNP3  149.86,38.1 180 bottom
POWER  72.39,7.62 180 top
R1  52.07,83.82 0 top
R2  57.15,80.01 270 top
R3  127.25,14.22 180 top
R4  48.26,52.07 0 bottom
R5  22.86,52.07 0 bottom
R6  99.57,70.61 270 top
R13  156.21,43.18 180 bottom
R14  156.21,40.64 180 bottom
R15  156.21,38.1 180 bottom
R16  147.32,49.53 270 bottom
R17  144.78,49.53 270 bottom
R18  141.22,49.02 270 bottom
R19  121.92,72.39 180 top
R20  109.22,69.85 0 top
R21  121.92,69.85 180 top
R22  109.22,67.31 0 top
R23  121.92,69.85 180 bottom
R24  109.22,64.77 0 bottom
R25  121.92,67.31 180 bottom
R26  121.92,64.77 180 bottom
R27  76.2,63.5 90 top
R28  73.66,62.23 90 top
R29  80.01,63.5 270 top
R30  82.55,62.23 270 top
SJ1  146.69,77.34 90 bottom
SJ2  57.15,83.82 90 top
SJ3  134.87,37.34 270 top
SPI_EXTERN  137.16,6.35 180 bottom
STECKER_BOX  143.51,30.48 180 bottom
U1  83.82,40.64 90 top
U$1  50.8,80.01 0 top
X1  59.69,7.62 0 bottom

### Tracks (layer width: path | path; a pad name or v marks a point on that pad's centre or on a via)
5V/2_F&J
  Bottom 0.254: SJ1.1 145.88,75.78 CAN.4
5V/2_FUSED
  Bottom 0.254: F2.P$2 143.9,78.11 SJ1.2
12V_FUSED  (7 unrouted)
!BH_L_RESET  (1 unrouted)
!BH_L_RESET_3V  (1 unrouted)
!BH_R_RESET  (1 unrouted)
!BH_R_RESET_3V  (1 unrouted)
+3V3  (12 unrouted)
+5V/1  (13 unrouted)
+5V/2  (5 unrouted)
  Top 0.61: JST_OPTICAL-FLOW.8 147.43,2.79 134.62,2.79 | 134.62,2.79 125.73,2.79 | 125.73,2.79 114.05,2.79 | JST_LIGHTBARRIER.1 125.73,7.58 125.73,2.79 | SPI_EXTERN.2 134.62,2.79 | U1.3 95.88,43.18 D1.A 97.47,41.59 C2.1 106.24,41.59 107.44,40.39 107.44,6.35 111,2.79 114.05,2.79 | 114.05,2.79 114.26,3.01 JST_SERVO.1
  Top 1.016: U1.3 92.86,79.65 94.45,81.24 JST_SERVO3.1 JST_SERVO2.1
  Bottom 0.254: 147.07,38.1 151.91,38.1 | PNP3.E 151.91,38.1 | 151.91,38.1 153.43,36.58 155.96,36.58 157.06,37.68 R15.2 R14.2 R13.2 | PNP2.E 147,38.17 147.07,38.1 | 139.19,55.08 139.19,39.37 140.46,38.1 143.26,38.1 | 143.26,38.1 147.07,38.1 | PNP1.E 143.26,39.13 143.26,38.1
  Bottom 0.406: F2.P$1 131.09,81.24 JST_SERVO2.1
+12V  (2 unrouted)
A_INT1
  Bottom 0.254: 9AXIS-IMU.7 17.78,63.25 18.8,64.26 35.56,64.26 36.32,65.02 36.32,71.37 38.35,73.41 67.06,73.41 P8.44
ADC1  (1 unrouted)
ADC1_1.8V  (1 unrouted)
  Bottom 0.254: R23.1 119.8,68.58 P9.39
ADC2  (1 unrouted)
ADC2_1.8V  (1 unrouted)
  Bottom 0.254: R25.1 119.38,67.31 P9.37
ADC3  (1 unrouted)
ADC3_1.8V  (1 unrouted)
  Bottom 0.254: R26.1 116.84,64.77 P9.38
BH_L_DIR  (1 unrouted)
BH_L_DIR_3V  (1 unrouted)
BH_L_FF1  (1 unrouted)
BH_L_FF1_3V  (1 unrouted)
BH_L_FF2  (1 unrouted)
BH_L_FF2_3V  (1 unrouted)
BH_L_PWM  (1 unrouted)
BH_L_PWM_3V  (1 unrouted)
BH_R_DIR  (1 unrouted)
BH_R_DIR_3V  (1 unrouted)
BH_R_FF1  (1 unrouted)
BH_R_FF1_3V  (1 unrouted)
BH_R_FF2  (1 unrouted)
BH_R_FF2_3V  (1 unrouted)
BH_R_PWM  (1 unrouted)
BH_R_PWM_3V  (1 unrouted)
CAN0_RX  (1 unrouted)
  Bottom 0.254: P9.19 116.84,44.45 114.3,44.45 113.79,43.94 103.89,43.94
CAN0_TX  (1 unrouted)
  Bottom 0.254: P9.20 103.89,43.18
CAN_RX  (1 unrouted)
CAN_TX  (1 unrouted)
CANH  (2 unrouted)
  Top 0.254: 63.25,84.33 147.57,84.33 150.11,81.79 150.11,73.91 152.88,71.15 CAN.2
CANL  (2 unrouted)
  Top 0.254: CAN.3 149.38,81.51 147.32,83.57 63.25,83.57
GND
  pour Bottom: 0,0 160.02,0 160.02,86.36 0,86.36
  pour Top: 0,0 160.02,0 160.02,86.36 0,86.36
I2C1_SCL  (1 unrouted)
I2C1_SDA  (1 unrouted)
IO1
  Top 0.254: LS_IO.20 113.03,64.77 123.19,64.77 125.73,62.23 129.29,62.23 130.81,60.71 IO_EXTERN.1
IO1_3V  (1 unrouted)
IO2
  Top 0.254: LS_IO.18 110.59,60.05 112.78,62.23 123.95,62.23 125.22,60.96 127.76,60.96 128.27,60.45 IO_EXTERN.2
IO2_3V  (1 unrouted)
IO3  (via drill 0.5)
  Top 0.254: LS_IO.17 111.96,59.38 v113.03,60.45
  Bottom 0.254: v113.03,60.45 114.81,62.23 119.63,62.23 120.65,61.21 127.76,61.21 129.54,59.44 129.54,55.88 IO_EXTERN.3
IO3_3V  (1 unrouted)
IO4
  Top 0.254: LS_IO.16 113.87,58.75 114.81,59.69 125.22,59.69 126.24,58.67 126.24,56.64 IO_EXTERN.4
IO4_3V  (1 unrouted)
IO5  (via drill 0.5)
  Top 0.254: LS_IO.15 113.11,58.09 v113.28,57.91
  Bottom 0.254: v113.28,57.91 113.28,58.17 114.81,59.69 119.38,59.69 120.14,58.93 124.21,58.93 124.97,58.17 124.97,55.88 127.51,53.34 129.54,53.34 IO_EXTERN.5
IO5_3V  (1 unrouted)
LB_ADC  (1 unrouted)
LB_ADC_1.8V  (2 unrouted)
LS_BH_L_OE  (1 unrouted)
LS_BH_R_OE  (1 unrouted)
LS_IO_OE  (1 unrouted)
LS_OF_OE
  Top 0.254: LS_OF.10 126.62,14.44 R3.2
M_DRDY
  Bottom 0.254: P8.43 68.58,72.39 38.86,72.39 37.34,70.87 37.34,64.77 36.07,63.25 20.83,63.25 20.32,62.74 9AXIS-IMU.6
N$1  (via drill 0.5)
  Top 0.254: v144.02,43.18 v153.67,43.18
  Bottom 0.254: PNP1.B 142.24,40.15 NPN1.C 142.41,43.18 v144.02,43.18 | v153.67,43.18 R13.1
N$2
  Bottom 0.254: PNP2.B 146.05,40.15 NPN2.C 147.15,44.45 151.13,44.45 152.4,43.18 152.4,41.4 153.16,40.64 R14.1
N$4
  Bottom 0.254: PNP3.B 149.86,40.15 149.86,40.64 | 149.86,40.64 NPN3.C | R15.1 154.18,38.1 151.64,40.64 149.86,40.64
N$9  (1 unrouted)
N$10  (1 unrouted)
OF_NCS
  Top 0.254: LS_OF.14 134.31,18.09 135.95,16.45 JST_OPTICAL-FLOW.3
OF_NCS_3V  (1 unrouted)
  Bottom 0.254: P9.28 116.84,52.07 118.36,52.07 121.92,48.51 121.92,48.01
OF_NPD  (via drill 0.5)
  Top 0.254: LS_OF.20 145.67,21.97 v146.3,21.34
  Bottom 0.254: v146.3,21.34 146.3,11.94 146.81,11.43 148.57,11.43 JST_OPTICAL-FLOW.5
OF_NPD_3V  (1 unrouted)
  Bottom 0.254: P9.25 120.9,48.01 120.9,47.5
OF_RST  (via drill 0.5)
  Top 0.254: LS_OF.18 144.68,20.68 v145.29,20.07
  Bottom 0.254: v145.29,20.07 145.29,7.37 146.2,6.45 JST_OPTICAL-FLOW.7
OF_RST_3V  (1 unrouted)
  Bottom 0.254: P9.27 122.68,48.77 122.68,48.51
P_EOC
  Bottom 0.254: 9AXIS-IMU.10 10.16,62.74 13.72,66.29 33.78,66.29 34.29,66.8 34.29,72.39 37.34,75.44 65.02,75.44 65.79,76.2 P8.46
PWM4
  Top 0.254: LS_IO.12 113.79,56.13 114.81,57.15 123.19,57.15 IO_EXTERN.6
PWM4_3V  (1 unrouted)
SCL  (2 unrouted)
SDA  (2 unrouted)
SERVO_PWM  (via drill 0.5)
  Top 0.254: v119.63,11.68 130.3,11.68 131.06,12.45 131.06,17.02 131.47,17.42 LS_OF.13
  Bottom 0.254: JST_SERVO.3 109.26,10.45 110.49,11.68 v119.63,11.68
SERVO_PWM2  (1 unrouted)
  Top 0.254: JST_SERVO2.3 130.81,76.2 129.29,74.68 124.71,74.68 121.92,77.47 106.93,77.47 106.43,76.96
SERVO_PWM2_3V  (1 unrouted)
SERVO_PWM3  (1 unrouted)
  Top 0.254: JST_SERVO3.3 125.69,76.24 122.94,78.99 105.92,78.99 104.9,77.98
SERVO_PWM3_3V  (1 unrouted)
SERVO_PWM_3V
  Top 0.254: LS_OF.8 113.64,17.42 112.78,18.29 112.78,34.54 113.79,35.56 P9.14
SPI1_CLK  (1 unrouted)
  Bottom 0.254: P9.31 126.75,49.78
SPI1_D0_MISO  (1 unrouted)
  Bottom 0.254: P9.29 118.62,55.88 125.48,49.02
SPI1_D1_MOSI  (1 unrouted)
  Bottom 0.254: P9.30 116.84,54.61 118.62,54.61 123.95,49.28 123.95,48.77
SPI_CLK  (via drill 0.5)
  Top 0.254: LS_OF.17 136.96,20.02 v137.16,19.81 | SPI_EXTERN.3 137.16,8.64 137.73,9.2 148.34,9.2 JST_OPTICAL-FLOW.6
  Bottom 0.254: v137.16,19.81 SPI_EXTERN.3
SPI_CS  (via drill 0.5)
  Top 0.254: v139.19,15.24 135.64,15.24 134.11,16.76 LS_OF.12
  Bottom 0.254: SPI_EXTERN.5 139.7,14.73 v139.19,15.24
SPI_CS_3V  (via drill 0.5)
  Top 0.254: v111.76,44.96 111.76,17.78 113.54,16 122.94,16 123.7,16.76 LS_OF.9
  Bottom 0.254: P9.26 113.03,50.8 111.76,49.53 v111.76,44.96
SPI_MISO  (via drill 0.5)
  Top 0.254: SPI_EXTERN.1 134.62,12.45 v136.02,13.84 136.12,13.95 JST_OPTICAL-FLOW.4 | LS_OF.16 135.31,19.38 v135.89,18.8
  Bottom 0.254: v135.89,18.8 135.89,13.72 v136.02,13.84
SPI_MOSI
  Top 0.254: SPI_EXTERN.4 138.43,6.35 145.8,6.35 147.07,7.62 149.35,7.62 150.11,8.38 150.11,17.43 JST_OPTICAL-FLOW.2 146.66,17.02 136.14,17.02 134.44,18.72 LS_OF.15
SW3
  Top 0.254: STECKER_BOX.9 143.76,36.58 136.65,36.58 135.89,37.34 SJ3.2
SW_BUNDLE-LED
  Bottom 0.254: PNP2.C 147.32,35.73 147.32,30.48 STECKER_BOX.8
SW_BUNDLE-LED_3V  (via drill 0.5)
  Top 0.254: P9.23 122.17,44.2 136.14,44.2 140.46,48.51 v143.51,48.51
  Bottom 0.254: R17.2 145.1,48.36 | 145.1,48.36 145.1,48.51 v143.51,48.51 | 145.1,48.36 NPN2.B
SW_BUNDLE_3V
  Top 0.254: P9.13 130.3,35.56 131.57,34.29 136.4,34.29 137.16,35.05 142.75,35.05 STECKER_BOX.7
SW_POWER-LED
  Bottom 0.254: STECKER_BOX.10 150.88,31.5 150.88,35.98 PNP3.C
SW_POWER-LED_3V  (via drill 0.5)
  Top 0.254: v120.9,43.69 121.67,42.93 136.4,42.93 139.95,46.48 147.32,46.48 148.29,47.45 v148.55,47.45
  Bottom 0.254: R16.2 v148.55,47.45 148.91,47.09 NPN3.B | P9.24 116.84,46.99 119.38,46.99 120.9,45.47 v120.9,43.69
SW_POWER_3V  (via drill 0.5)
  Top 0.254: SJ3.1 121.67,38.86 v119.89,37.08
  Bottom 0.254: v119.89,37.08 119.89,35.05 119.13,34.29 116.84,34.29 P9.12
SW_PWR_BUT  (via drill 0.5)
  Top 0.254: SJ3.3 v133.6,35.81 | v129.54,31.75 128.27,30.48 P9.9
  Bottom 0.254: v133.6,35.81 v129.54,31.75
SW_VISION-LED
  Bottom 0.254: PNP1.C 142.24,30.48 STECKER_BOX.6
SW_VISION-LED_3V  (via drill 0.5)
  Top 0.254: P9.15 121.41,41.4 138.43,41.4 v140.46,43.43
  Bottom 0.254: R18.2 141.29,47.73 NPN1.B 140.46,44.72 v140.46,43.43
SW_VISION_3V
  Top 0.254: P9.11 136.65,33.02 137.41,33.78 141.48,33.78 STECKER_BOX.5
T_INT1
  Bottom 0.254: P8.45 68.58,74.93 66.04,74.93 65.53,74.42 37.85,74.42 35.31,71.88 35.31,65.53 35.05,65.28 17.02,65.28 15.24,63.5 9AXIS-IMU.8
(copper drawn outside any net)
  shapes: Top area x7